# Altium schematic sheet MB-03-CoProcessor.SchDoc
size 304 x 228 mm
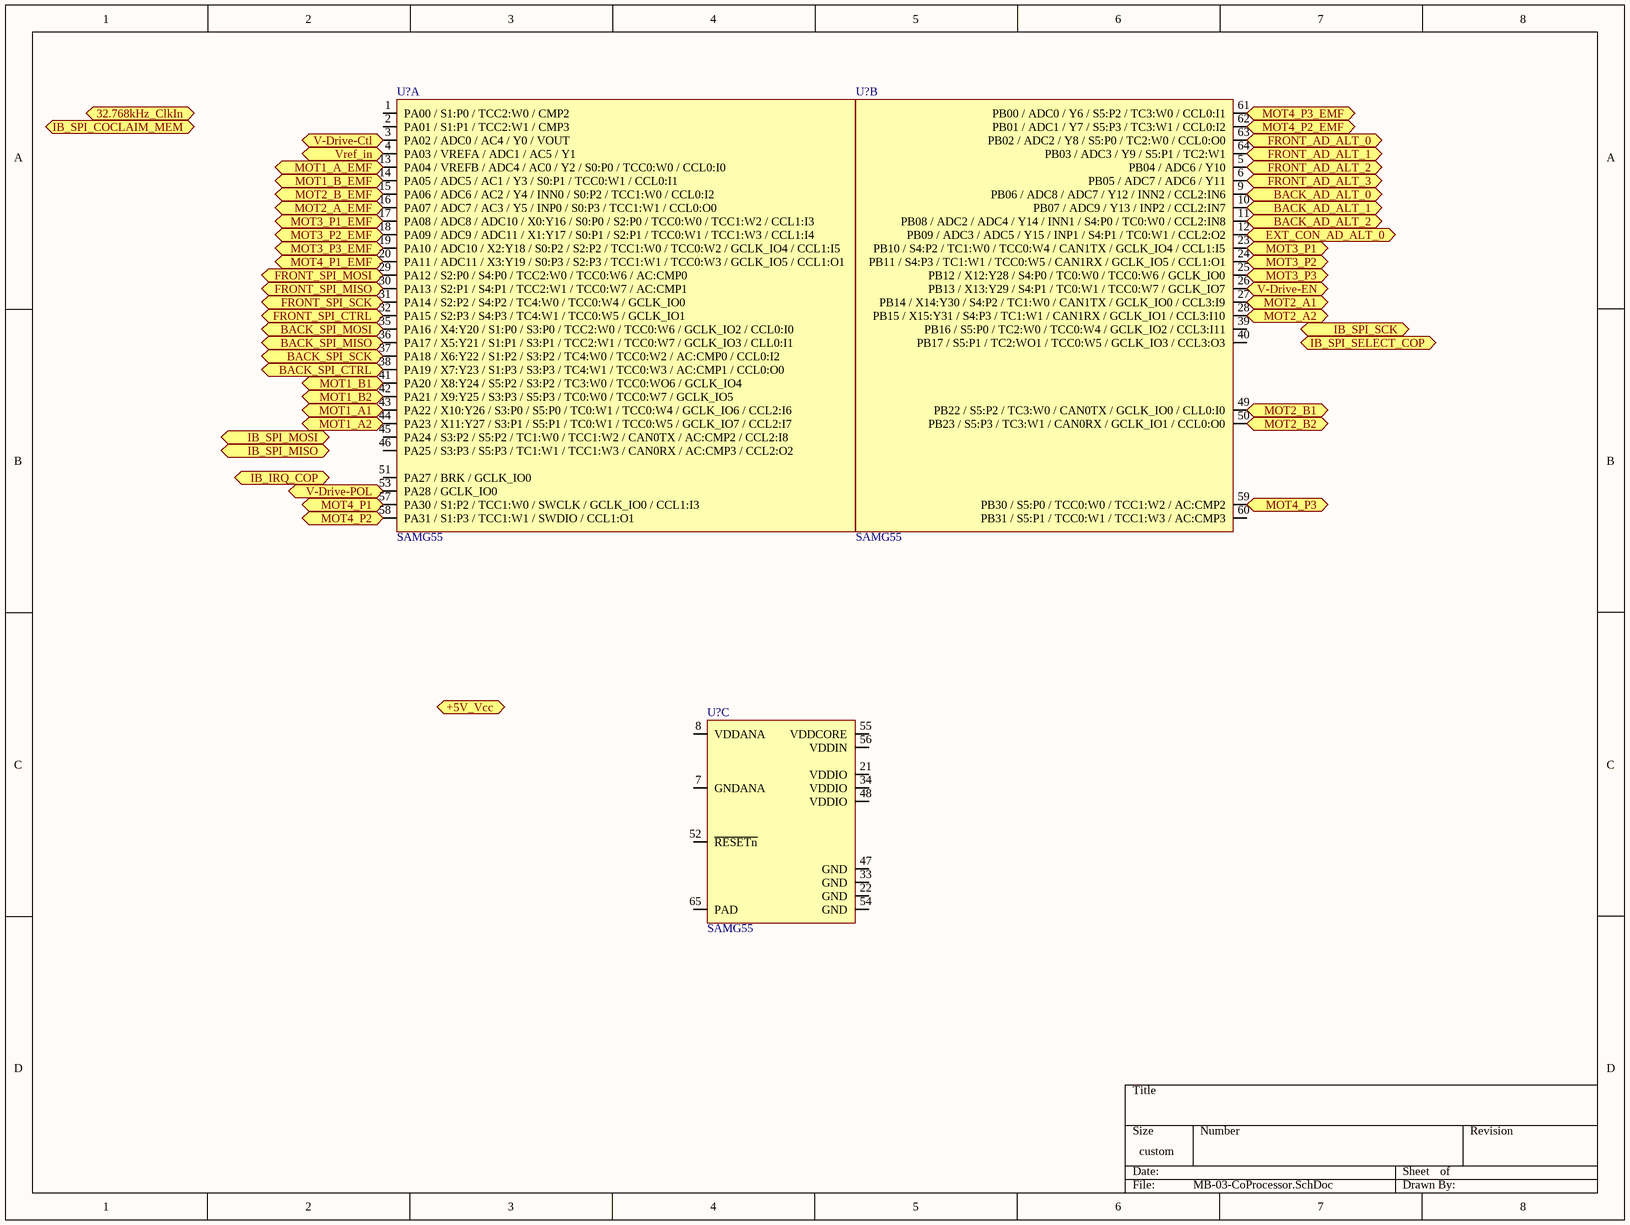
[diagram p0: MB-03-CoProcessor.SchDoc]

## Parts
(Parts that share a designator on the sheet are numbered #1, #2 ... from top to bottom, then left to right.)
U?#1  SAMG55  (part A of 3)
U?#2  SAMG55  (part B of 3)
U?#3  SAMG55  (part C of 3)

## Ports
32.768kHz_ClkIn (in), +5V_Vcc (in), BACK_AD_ALT_0 (bidir), BACK_AD_ALT_1 (bidir), BACK_AD_ALT_2 (bidir), BACK_SPI_CTRL (bidir), BACK_SPI_MISO (in), BACK_SPI_MOSI (out), BACK_SPI_SCK (out), EXT_CON_AD_ALT_0 (bidir), FRONT_AD_ALT_0 (bidir), FRONT_AD_ALT_1 (bidir), FRONT_AD_ALT_2 (bidir), FRONT_AD_ALT_3 (bidir), FRONT_SPI_CTRL (bidir), FRONT_SPI_MISO (in), FRONT_SPI_MOSI (out), FRONT_SPI_SCK (out), IB_IRQ_COP (out), IB_SPI_COCLAIM_MEM (out), IB_SPI_MISO (bidir), IB_SPI_MOSI (bidir), IB_SPI_SCK (bidir), IB_SPI_SELECT_COP (in), MOT1_A1 (out), MOT1_A2 (out), MOT1_A_EMF (in), MOT1_B1 (out), MOT1_B2 (out), MOT1_B_EMF (in), MOT2_A1 (out), MOT2_A2 (out), MOT2_A_EMF (in), MOT2_B1 (out), MOT2_B2 (out), MOT2_B_EMF (in), MOT3_P1 (out), MOT3_P1_EMF (in), MOT3_P2 (out), MOT3_P2_EMF (in), MOT3_P3 (out), MOT3_P3_EMF (in), MOT4_P1 (out), MOT4_P1_EMF (in), MOT4_P2 (out), MOT4_P2_EMF (in), MOT4_P3 (out), MOT4_P3_EMF (in), V-Drive-Ctl (out), V-Drive-EN (out), V-Drive-POL (out), Vref_in (in)

## Nets
BACK_AD_ALT_0: U?#2.9(PB06_/_ADC8_/_ADC7_/_Y12_/_INN2_/_CCL2:IN6) ; port BACK_AD_ALT_0
BACK_AD_ALT_1: U?#2.10(PB07_/_ADC9_/_Y13_/_INP2_/_CCL2:IN7) ; port BACK_AD_ALT_1
BACK_AD_ALT_2: U?#2.11(PB08_/_ADC2_/_ADC4_/_Y14_/_INN1_/_S4:P0_/_TC0:W0_/_CCL2:IN8) ; port BACK_AD_ALT_2
BACK_SPI_CTRL: U?#1.38(PA19_/_X7:Y23_/_S1:P3_/_S3:P3_/_TC4:W1_/_TCC0:W3_/_AC:CMP1_/_CCL0:O0) ; port BACK_SPI_CTRL
BACK_SPI_MISO: U?#1.36(PA17_/_X5:Y21_/_S1:P1_/_S3:P1_/_TCC2:W1_/_TCC0:W7_/_GCLK_IO3_/_CLL0:I1) ; port BACK_SPI_MISO
BACK_SPI_MOSI: U?#1.35(PA16_/_X4:Y20_/_S1:P0_/_S3:P0_/_TCC2:W0_/_TCC0:W6_/_GCLK_IO2_/_CCL0:I0) ; port BACK_SPI_MOSI
BACK_SPI_SCK: U?#1.37(PA18_/_X6:Y22_/_S1:P2_/_S3:P2_/_TC4:W0_/_TCC0:W2_/_AC:CMP0_/_CCL0:I2) ; port BACK_SPI_SCK
EXT_CON_AD_ALT_0: U?#2.12(PB09_/_ADC3_/_ADC5_/_Y15_/_INP1_/_S4:P1_/_TC0:W1_/_CCL2:O2) ; port EXT_CON_AD_ALT_0
FRONT_AD_ALT_0: U?#2.63(PB02_/_ADC2_/_Y8_/_S5:P0_/_TC2:W0_/_CCL0:O0) ; port FRONT_AD_ALT_0
FRONT_AD_ALT_1: U?#2.64(PB03_/_ADC3_/_Y9_/_S5:P1_/_TC2:W1) ; port FRONT_AD_ALT_1
FRONT_AD_ALT_2: U?#2.5(PB04_/_ADC6_/_Y10) ; port FRONT_AD_ALT_2
FRONT_AD_ALT_3: U?#2.6(PB05_/_ADC7_/_ADC6_/_Y11) ; port FRONT_AD_ALT_3
FRONT_SPI_CTRL: U?#1.32(PA15_/_S2:P3_/_S4:P3_/_TC4:W1_/_TCC0:W5_/_GCLK_IO1) ; port FRONT_SPI_CTRL
FRONT_SPI_MISO: U?#1.30(PA13_/_S2:P1_/_S4:P1_/_TCC2:W1_/_TCC0:W7_/_AC:CMP1) ; port FRONT_SPI_MISO
FRONT_SPI_MOSI: U?#1.29(PA12_/_S2:P0_/_S4:P0_/_TCC2:W0_/_TCC0:W6_/_AC:CMP0) ; port FRONT_SPI_MOSI
FRONT_SPI_SCK: U?#1.31(PA14_/_S2:P2_/_S4:P2_/_TC4:W0_/_TCC0:W4_/_GCLK_IO0) ; port FRONT_SPI_SCK
MOT1_A1: U?#1.43(PA22_/_X10:Y26_/_S3:P0_/_S5:P0_/_TC0:W1_/_TCC0:W4_/_GCLK_IO6_/_CCL2:I6) ; port MOT1_A1
MOT1_A2: U?#1.44(PA23_/_X11:Y27_/_S3:P1_/_S5:P1_/_TC0:W1_/_TCC0:W5_/_GCLK_IO7_/_CCL2:I7) ; port MOT1_A2
MOT1_A_EMF: U?#1.13(PA04_/_VREFB_/_ADC4_/_AC0_/_Y2_/_S0:P0_/_TCC0:W0_/_CCL0:I0) ; port MOT1_A_EMF
MOT1_B1: U?#1.41(PA20_/_X8:Y24_/_S5:P2_/_S3:P2_/_TC3:W0_/_TCC0:WO6_/_GCLK_IO4) ; port MOT1_B1
MOT1_B2: U?#1.42(PA21_/_X9:Y25_/_S3:P3_/_S5:P3_/_TC0:W0_/_TCC0:W7_/_GCLK_IO5) ; port MOT1_B2
MOT1_B_EMF: U?#1.14(PA05_/_ADC5_/_AC1_/_Y3_/_S0:P1_/_TCC0:W1_/_CCL0:I1) ; port MOT1_B_EMF
MOT2_A1: U?#2.27(PB14_/_X14:Y30_/_S4:P2_/_TC1:W0_/_CAN1TX_/_GCLK_IO0_/_CCL3:I9) ; port MOT2_A1
MOT2_A2: U?#2.28(PB15_/_X15:Y31_/_S4:P3_/_TC1:W1_/_CAN1RX_/_GCLK_IO1_/_CCL3:I10) ; port MOT2_A2
MOT2_A_EMF: U?#1.16(PA07_/_ADC7_/_AC3_/_Y5_/_INP0_/_S0:P3_/_TCC1:W1_/_CCL0:O0) ; port MOT2_A_EMF
MOT2_B1: U?#2.49(PB22_/_S5:P2_/_TC3:W0_/_CAN0TX_/_GCLK_IO0_/_CLL0:I0) ; port MOT2_B1
MOT2_B2: U?#2.50(PB23_/_S5:P3_/_TC3:W1_/_CAN0RX_/_GCLK_IO1_/_CCL0:O0) ; port MOT2_B2
MOT2_B_EMF: U?#1.15(PA06_/_ADC6_/_AC2_/_Y4_/_INN0_/_S0:P2_/_TCC1:W0_/_CCL0:I2) ; port MOT2_B_EMF
MOT3_P1: U?#2.23(PB10_/_S4:P2_/_TC1:W0_/_TCC0:W4_/_CAN1TX_/_GCLK_IO4_/_CCL1:I5) ; port MOT3_P1
MOT3_P1_EMF: U?#1.17(PA08_/_ADC8_/_ADC10_/_X0:Y16_/_S0:P0_/_S2:P0_/_TCC0:W0_/_TCC1:W2_/_CCL1:I3) ; port MOT3_P1_EMF
MOT3_P2: U?#2.24(PB11_/_S4:P3_/_TC1:W1_/_TCC0:W5_/_CAN1RX_/_GCLK_IO5_/_CCL1:O1) ; port MOT3_P2
MOT3_P2_EMF: U?#1.18(PA09_/_ADC9_/_ADC11_/_X1:Y17_/_S0:P1_/_S2:P1_/_TCC0:W1_/_TCC1:W3_/_CCL1:I4) ; port MOT3_P2_EMF
MOT3_P3: U?#2.25(PB12_/_X12:Y28_/_S4:P0_/_TC0:W0_/_TCC0:W6_/_GCLK_IO0) ; port MOT3_P3
MOT3_P3_EMF: U?#1.19(PA10_/_ADC10_/_X2:Y18_/_S0:P2_/_S2:P2_/_TCC1:W0_/_TCC0:W2_/_GCLK_IO4_/_CCL1:I5) ; port MOT3_P3_EMF
MOT4_P1: U?#1.57(PA30_/_S1:P2_/_TCC1:W0_/_SWCLK_/_GCLK_IO0_/_CCL1:I3) ; port MOT4_P1
MOT4_P1_EMF: U?#1.20(PA11_/_ADC11_/_X3:Y19_/_S0:P3_/_S2:P3_/_TCC1:W1_/_TCC0:W3_/_GCLK_IO5_/_CCL1:O1) ; port MOT4_P1_EMF
MOT4_P2: U?#1.58(PA31_/_S1:P3_/_TCC1:W1_/_SWDIO_/_CCL1:O1) ; port MOT4_P2
MOT4_P2_EMF: U?#2.62(PB01_/_ADC1_/_Y7_/_S5:P3_/_TC3:W1_/_CCL0:I2) ; port MOT4_P2_EMF
MOT4_P3: U?#2.59(PB30_/_S5:P0_/_TCC0:W0_/_TCC1:W2_/_AC:CMP2) ; port MOT4_P3
MOT4_P3_EMF: U?#2.61(PB00_/_ADC0_/_Y6_/_S5:P2_/_TC3:W0_/_CCL0:I1) ; port MOT4_P3_EMF
V-Drive-Ctl: U?#1.3(PA02_/_ADC0_/_AC4_/_Y0_/_VOUT) ; port V-Drive-Ctl
V-Drive-EN: U?#2.26(PB13_/_X13:Y29_/_S4:P1_/_TC0:W1_/_TCC0:W7_/_GCLK_IO7) ; port V-Drive-EN
V-Drive-POL: U?#1.53(PA28_/_GCLK_IO0) ; port V-Drive-POL
Vref_in: U?#1.4(PA03_/_VREFA_/_ADC1_/_AC5_/_Y1) ; port Vref_in

Not connected (* = marked no-connect by the designer): U?#1 1(PA00_/_S1:P0_/_TCC2:W0_/_CMP2) 2(PA01_/_S1:P1_/_TCC2:W1_/_CMP3) 45(PA24_/_S3:P2_/_S5:P2_/_TC1:W0_/_TCC1:W2_/_CAN0TX_/_AC:CMP2_/_CCL2:I8) 46(PA25_/_S3:P3_/_S5:P3_/_TC1:W1_/_TCC1:W3_/_CAN0RX_/_AC:CMP3_/_CCL2:O2) 51(PA27_/_BRK_/_GCLK_IO0); U?#2 39(PB16_/_S5:P0_/_TC2:W0_/_TCC0:W4_/_GCLK_IO2_/_CCL3:I11) 40(PB17_/_S5:P1_/_TC2:WO1_/_TCC0:W5_/_GCLK_IO3_/_CCL3:O3) 60(PB31_/_S5:P1_/_TCC0:W1_/_TCC1:W3_/_AC:CMP3); U?#3 7(GNDANA) 8(VDDANA) 21(VDDIO) 22(GND) 33(GND) 34(VDDIO) 47(GND) 48(VDDIO) 52(~{RESETn}) 54(GND) 55(VDDCORE) 56(VDDIN) 65(PAD)

## Library data of the parts
U?#1-U?#3 = CHIP_ATM_SAMC21J-M: Atmel ARM M0+ 64pin SAMC21